# EAGLE design morseSounder (EAGLE 6.5.0)
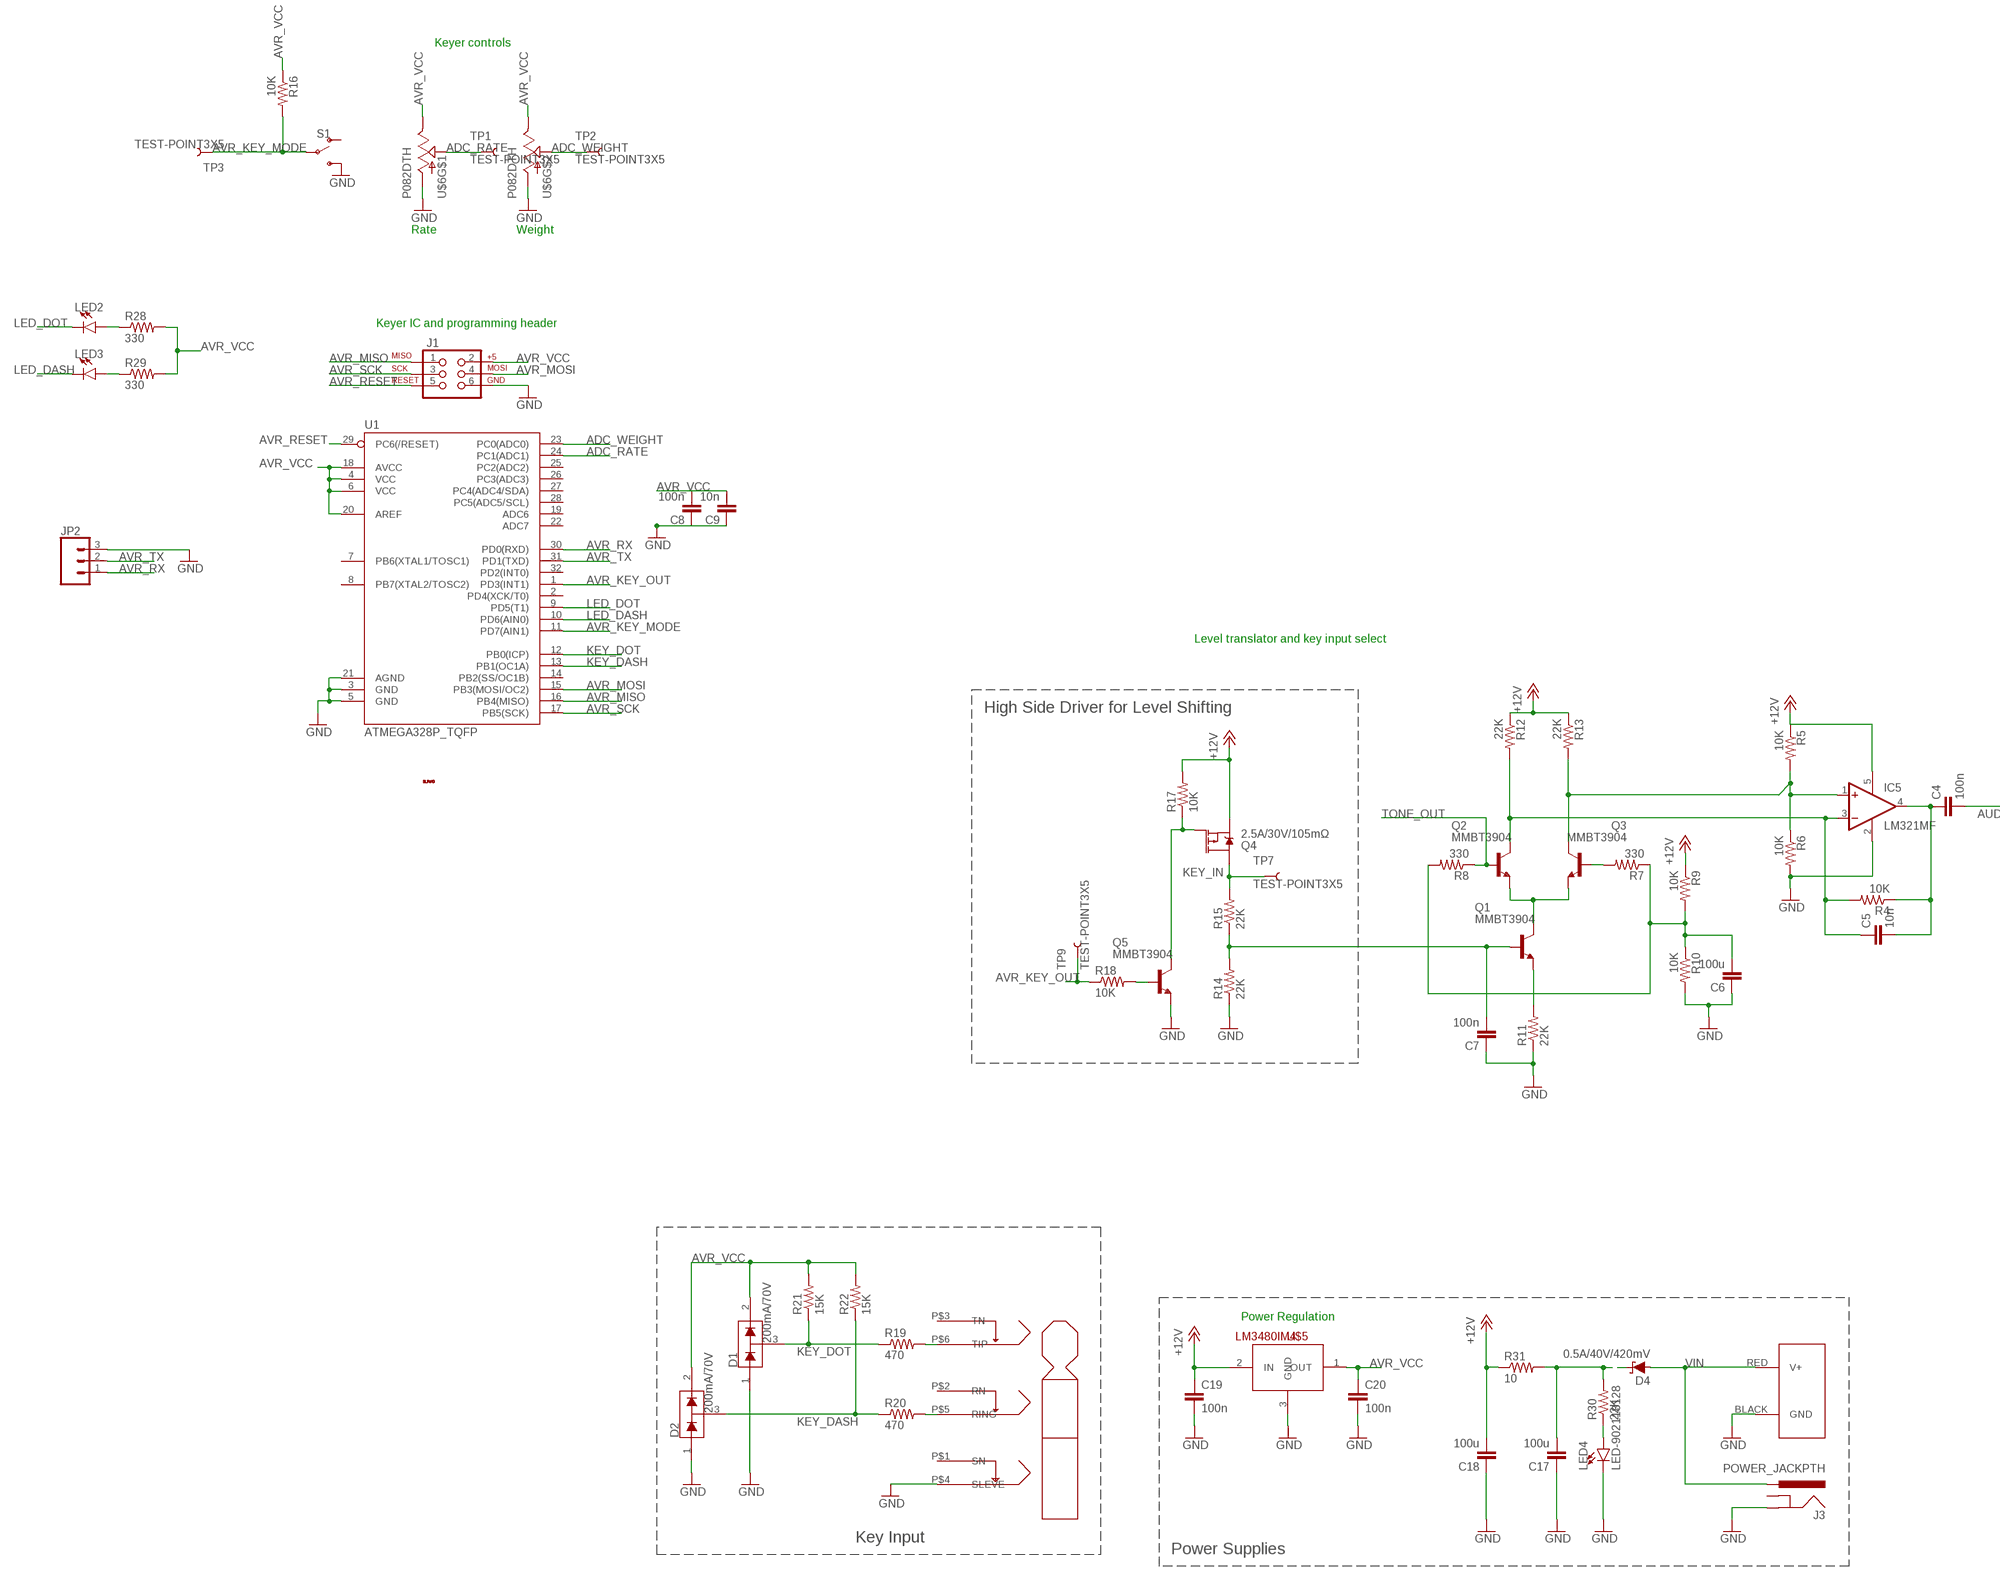
[diagram p0: schematic, sheet 1, part 1 of 2]
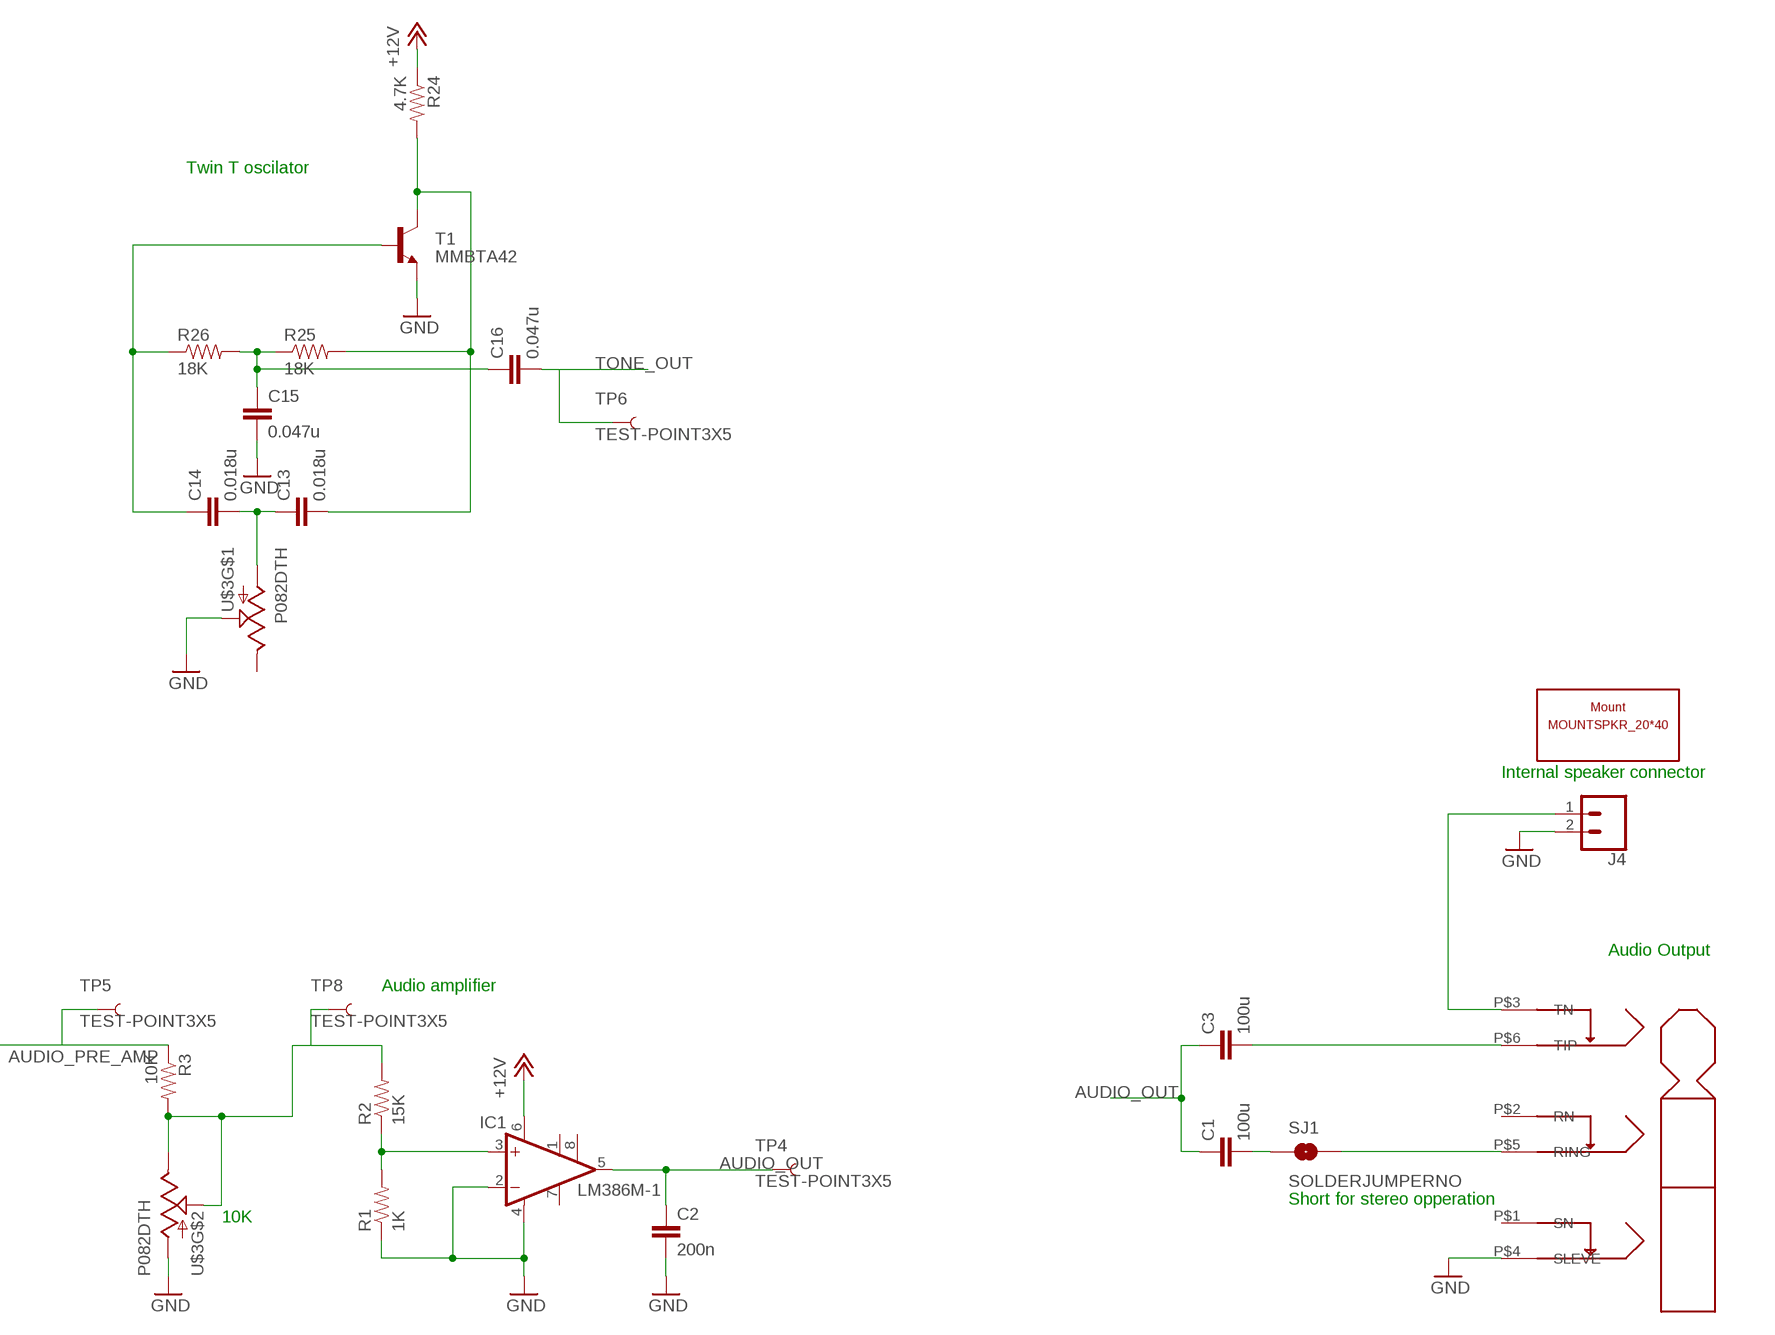
[diagram p1: schematic, sheet 1, part 2 of 2]

## Parts
C1  100u  CAP0805  [0805]
C2  200n  CAP0805  [0805]
C3  100u  CAP0805  [0805]
C4  100n  CAP0805  [0805]
C5  10n  CAP0805  [0805]
C6  100u  CAP0805  [0805]
C7  100n  CAP0805  [0805]
C8  100n  CAP0805  [0805]
C9  10n  CAP0805  [0805]
C13  0.018u  CAP0805  [0805]
C14  0.018u  CAP0805  [0805]
C15  0.047u  CAP0805  [0805]
C16  0.047u  CAP0805  [0805]
C17  100u  CAP0805  [0805]
C18  100u  CAP0805  [0805]
C19  100n  CAP0805  [0805]
C20  100n  CAP0805  [0805]
D1  200mA/70V  BAV99  [SOT23-3]
D2  200mA/70V  BAV99  [SOT23-3]
D4  0.5A/40V/420mV  DIODE-SCHOTTKY-PMEG4005EJ  [SOD-323]
IC1  LM386M-1  [SO08]
IC5  LM321MF  [SOT23-5]
J1  AVR_SPI_PRG_6PTH  [2X3]
J2  POWERPOLE_POWER25A_HORIZONTAL_G2  [POWERPOLE_PAIR_25A_HORIZ_G2]
J3  POWER_JACKPTH  [POWER_JACK_PTH]
J4  CONN_02  [1X02]
JP2  CONN_03  [1X03]
LED2  LED-RED1206  [LED-1206]
LED3  LED-RED1206  [LED-1206]
LED4  LED-902118128  [MULTICOMP-2118128]
Q1  MMBT3904  MMBT3904LT1-NPN-SOT23-BEC  [SOT23-BEC]
Q2  MMBT3904  MMBT3904LT1-NPN-SOT23-BEC  [SOT23-BEC]
Q3  MMBT3904  MMBT3904LT1-NPN-SOT23-BEC  [SOT23-BEC]
Q4  2.5A/30V/105mΩ  MOSFET_PCH-DMG2307L  [SOT23-3]
Q5  MMBT3904  MMBT3904LT1-NPN-SOT23-BEC  [SOT23-BEC]
R1  1K  RESISTOR0805-RES  [0805]
R2  15K  RESISTOR0805-RES  [0805]
R3  10K  RESISTOR0805-RES  [0805]
R4  10K  RESISTOR0805-RES  [0805]
R5  10K  RESISTOR0805-RES  [0805]
R6  10K  RESISTOR0805-RES  [0805]
R7  330  RESISTOR0805-RES  [0805]
R8  330  RESISTOR0805-RES  [0805]
R9  10K  RESISTOR0805-RES  [0805]
R10  10K  RESISTOR0805-RES  [0805]
R11  22K  RESISTOR0805-RES  [0805]
R12  22K  RESISTOR0805-RES  [0805]
R13  22K  RESISTOR0805-RES  [0805]
R14  22K  RESISTOR0805-RES  [0805]
R15  22K  RESISTOR0805-RES  [0805]
R16  10K  RESISTOR0805-RES  [0805]
R17  10K  RESISTOR0805-RES  [0805]
R18  10K  RESISTOR0805-RES  [0805]
R19  470  RESISTOR0805-RES  [0805]
R20  470  RESISTOR0805-RES  [0805]
R21  15K  RESISTOR0805-RES  [0805]
R22  15K  RESISTOR0805-RES  [0805]
R24  4.7K  RESISTOR0805-RES  [0805]
R25  18K  RESISTOR0805-RES  [0805]
R26  18K  RESISTOR0805-RES  [0805]
R28  330  RESISTOR0805-RES  [0805]
R29  330  RESISTOR0805-RES  [0805]
R30  22K  RESISTOR0805-RES  [0805]
R31  10  RESISTOR0805-RES  [0805]
S1  SWITCH-SPDTTE-1825232-1  [TE-1825232-1]
SJ1  SOLDERJUMPERNO  [SJ_2S-NO]
T1  MMBTA42  TRANSISTOR_NPNSOT23  [SOT23]
TP1  TEST-POINT3X5  [PAD.03X.05]
TP2  TEST-POINT3X5  [PAD.03X.05]
TP3  TEST-POINT3X5  [PAD.03X.05]
TP4  TEST-POINT3X5  [PAD.03X.05]
TP5  TEST-POINT3X5  [PAD.03X.05]
TP6  TEST-POINT3X5  [PAD.03X.05]
TP7  TEST-POINT3X5  [PAD.03X.05]
TP8  TEST-POINT3X5  [PAD.03X.05]
TP9  TEST-POINT3X5  [PAD.03X.05]
U1  ATMEGA328P_TQFP  [TQFP32-08]
U$1  NRJ6HH  [NRJ6HH]
U$2  NRJ6HH  [NRJ6HH]
U$3  P082DTH  [P082D]
U$4  MOUNTSPKR_20*40  [SKR_MNT]
U$5  LM3480IM4  [SOT23-3]
U$6  P082DTH  [P082D]
U$7  LOGO_SUWSLOGO_LARGE  [LOGO_SUWS]

## Nets
+12V: C18.2 C19.1 IC1.6(VS) IC5.5(V+) Q4.2(S) R5.1 R9.1 R12.1 R13.1 R17.2 R24.1 R31.1 U$5.2(IN)
ADC_RATE: TP1.P$1 U1.24(PC1(ADC1)) U$6.F2(S)
ADC_WEIGHT: TP2.P$1 U1.23(PC0(ADC0)) U$6.R2(S)
AUDIO_OUT: C1.1 C2.1 C3.1 IC1.5(OUT) TP4.P$1
AUDIO_PRE_AMP: C4.2 R3.1 TP5.P$1
AVR_KEY_MODE: R16.2 S1.2(P) TP3.P$1 U1.11(PD7(AIN1))
AVR_KEY_OUT: R18.1 TP9.P$1 U1.1(PD3(INT1))
AVR_MISO: J1.1 U1.16(PB4(MISO))
AVR_MOSI: J1.4 U1.15(PB3(MOSI/OC2))
AVR_RESET: J1.5 U1.29(PC6(/RESET))
AVR_RX: JP2.1 U1.30(PD0(RXD))
AVR_SCK: J1.3 U1.17(PB5(SCK))
AVR_TX: JP2.2 U1.31(PD1(TXD))
AVR_VCC: C8.2 C9.2 C20.1 D1.2(C2) D2.2(C2) J1.2 R16.1 R21.2 R22.2 R28.2 R29.2 U1.4(VCC) U1.6(VCC) U1.18(AVCC) U1.20(AREF) U$5.1(OUT) U$6.F3(E) U$6.R3(E)
GND: C2.2 C6.1 C7.1 C8.1 C9.1 C15.2 C17.1 C18.1 C19.2 C20.2 D1.1(A1) D2.1(A1) IC1.2(-IN) IC1.4(GND) IC5.2(V-) J1.6 J2.BLACK(GND) J3.GND J4.2 JP2.3 LED4.P$2(C) Q5.E R1.1 R6.2 R10.2 R11.1 R14.1 S1.3(S) T1.2(E) U1.3(GND) U1.5(GND) U1.21(AGND) U$1.P$4(SLEVE) U$2.P$4(SLEVE) U$3.F2(S) U$3.R1(A) U$5.3(GND) U$6.F1(A) U$6.R1(A)
KEY_DASH: D2.3(COM) R20.1 R22.1 U1.13(PB1(OC1A))
KEY_DOT: D1.3(COM) R19.1 R21.1 U1.12(PB0(ICP))
KEY_IN: Q4.3(D) R15.2 TP7.P$1
LED_DASH: LED3.C U1.10(PD6(AIN0))
LED_DOT: LED2.C U1.9(PD5(T1))
N$1: C3.2 U$2.P$6(TIP)
N$2: C1.2 SJ1.1
N$3: IC1.3(+IN) R1.2 R2.1
N$4: C17.2 D4.C R30.2 R31.2
N$5: C4.1 C5.2 IC5.4(OUT) R4.1
N$6: C5.1 IC5.3(-IN) Q2.C R4.2 R12.2
N$7: IC5.1(+IN) Q3.C R5.2 R6.1 R13.2
N$8: Q1.C Q2.E Q3.E
N$9: C7.2 Q1.B R14.2 R15.1
N$10: R20.2 U$1.P$5(RING)
N$11: Q3.B R7.2
N$12: C6.2 R7.1 R8.2 R9.2 R10.1
N$13: Q1.E R11.2
N$14: SJ1.2 U$2.P$5(RING)
N$15: R2.2 R3.2 TP8.P$1 U$3.R2(S) U$3.R3(E)
N$16: Q5.B R18.2
N$17: Q4.1(G) Q5.C R17.1
N$18: R19.2 U$1.P$6(TIP)
N$23: C13.2 R24.2 R25.2 T1.3(C)
N$24: C14.1 R26.1 T1.1(B)
N$25: C15.1 C16.1 R25.1 R26.2
N$26: C13.1 C14.2 U$3.F1(A)
N$28: J4.1 U$2.P$3(TN)
N$29: LED3.A R29.1
N$33: LED2.A R28.1
N$36: LED4.P$1(A) R30.1
TONE_OUT: C16.2 Q2.B R8.1 TP6.P$1
VIN: D4.A J2.RED(V+) J3.PWR
Unconnected: IC1.1(GAIN) IC1.7(BYPASS) IC1.8(GAIN) J3.GNDBREAK S1.1(O) U1.2(PD4(XCK/T0)) U1.7(PB6(XTAL1/TOSC1)) U1.8(PB7(XTAL2/TOSC2)) U1.14(PB2(SS/OC1B)) U1.19(ADC6) U1.22(ADC7) U1.25(PC2(ADC2)) U1.26(PC3(ADC3)) U1.27(PC4(ADC4/SDA)) U1.28(PC5(ADC5/SCL)) U1.32(PD2(INT0)) U$1.P$1(SN) U$1.P$2(RN) U$1.P$3(TN) U$2.P$1(SN) U$2.P$2(RN) U$3.F3(E)

## Notes on the sheet
- Keyer controls
- Rate | Weight | Twin T oscilator
- Keyer IC and programming header
- Internal speaker connector
- Level translator and key input select
- High Side Driver for Level Shifting
- Audio Output
- Audio amplifier
- Short for stereo opperation
- 10K
- Power Regulation
- Key Input
- Power Supplies

## Library data of the parts
C1-C9 C13-C20 = SparkFun:CAP: Capacitor Standard 0603 ceramic capacitor, and 0.1" leaded capacitor.
D1 D2 = SparkFun-DiscreteSemi:BAV99: Series-pair diode array Two small signal silicon diodes connected anode to cathode. Connections to all three nodes available. Link to datasheet <https://www.fairchildsemi.com/datasheets/BA/BAV99.pdf> SparkFun Products: SparkFun AutoDriver <https://www.sparkfun.com/products/13752>; PROD_ID: DIO-10647
D4 = SparkFun-DiscreteSemi:DIODE-SCHOTTKY: Schottky diode A Schottky diode is a semiconductor diode which has a low forward voltage drop and a very fast switching action.; PROD_ID: DIO-10955
IC1 = linear:LM386?-*: Low Voltage Audio Power Amplifier Source: http://cache.national.com/ds/LM/LM386.pdf
IC5 = linear:LM321?*: Low Power Single Op Amp Source: http://cache.national.com/ds/LM/LM321.pdf
J1 = SparkFun:AVR_SPI_PRG_6: AVR ISP 6 Pin This is the reduced ISP connector for AVR programming. Common on Arduino. This footprint will take up less PCB space and can be used with a 10-pin to 6-pin adapter such as SKU: BOB-08508
J2 = powerpoles:POWERPOLE_POWER: Anderson Powerpole Power Connector using ameteur radio standard layout
J3 = SparkFun:POWER_JACK: Power Jack This is the standard 5.5mm barrel jack for power. The PTH is the most common, proven, reliable, footprint. All others are experimental. The Slot footprint only works if the mill layer is transmitted to the PCB fab house so be warned. Spark Fun Electronics SKU : PRT-00119. Mating wall wart : TOL-00298 (and others)
J4 = SparkFun-Connectors:CONN_02: Multi connection point. Often used as Generic Header-pin footprint for 0.1 inch spaced/style header connections On any of the 0.1 inch spaced packages, you can populate with these: Break Away Headers - Straight <https://www.sparkfun.com/products/116> (PRT-00116) Break Away Male Headers - Right Angle <https://www.sparkfun.com/products/553> (PRT-00553) Female Headers <https://www.sparkfun.com/products/115> (PRT-00115) Break Away Headers - Machine Pin <https://www.sparkfun.com/products/117> (PRT-00117) Break Away Female Headers - Swiss Machine Pin <https://www.sparkfun.com/products/743> (PRT-00743) For SCREWTERMINALS and SPRING TERMINALS visit here: Screw Terimnals on SparkFun.com <https://www.sparkfun.com/search/results?term=Screw+Terminals> (5mm/3.5mm/2.54mm spacing) This device is also useful as a general connection point to wire up your design to another part of your project. Our various solder wires solder well into these plated through hole pads. Hook-Up Wire - Assortment (Stranded, 22 AWG) <https://www.sparkfun.com/products/11375> (PRT-11375) Hook-Up Wire - Assortment (Solid Core, 22 AWG) <https://www.sparkfun.com/products/11367> (PRT-11367) View the entire wire category on our website here <https://www.sparkfun.com/categories/141> Special notes: Molex polarized connector foot print use with: PRT-08233 with associated crimp pins and housings. 2.54_SCREWTERM for use with PRT-10571. 3.5mm Screw Terminal footprints for PRT-08084 5mm Screw Terminal footprints for use with PRT-08432
JP2 = SparkFun-Connectors:CONN_03: Multi connection point. Often used as Generic Header-pin footprint for 0.1 inch spaced/style header connections On any of the 0.1 inch spaced packages, you can populate with these: Break Away Headers - Straight <https://www.sparkfun.com/products/116> (PRT-00116) Break Away Male Headers - Right Angle <https://www.sparkfun.com/products/553> (PRT-00553) Female Headers <https://www.sparkfun.com/products/115> (PRT-00115) Break Away Headers - Machine Pin <https://www.sparkfun.com/products/117> (PRT-00117) Break Away Female Headers - Swiss Machine Pin <https://www.sparkfun.com/products/743> (PRT-00743) Stackable Header - 3 Pin (Female, 0.1") <https://www.sparkfun.com/products/13875> (PRT-13875) For SCREWTERMINALS and SPRING TERMINALS visit here: Screw Terimnals on SparkFun.com <https://www.sparkfun.com/search/results?term=Screw+Terminals> (5mm/3.5mm/2.54mm spacing) This device is also useful as a general connection point to wire up your design to another part of your project. Our various solder wires solder well into these plated through hole pads. Hook-Up Wire - Assortment (Stranded, 22 AWG) <https://www.sparkfun.com/products/11375> (PRT-11375) Hook-Up Wire - Assortment (Solid Core, 22 AWG) <https://www.sparkfun.com/products/11367> (PRT-11367) View the entire wire category on our website here <https://www.sparkfun.com/categories/141> Special notes: Molex polarized connector foot print use with SKU : PRT-08232 with associated crimp pins and housings.
LED2 LED3 = SparkFun-LED:LED-RED: Red SMD LED Used in manufacturing of most products at SparkFun Packages: 0603 - SMD 0603 package [Product Link] <http://docs.avagotech.com/docs/AV02-0551EN> 0603 SMART - SMD 0603 SMART package ( more efficient and expensive)[Product Link] <http://www.osram-os.com/Graphics/XPic2/00077099_0.pdf> 1206 - SMD1206 package [Product Link] <https://www.sparkfun.com/datasheets/DevTools/LilyPad/Q150OVS4.pdff> SparkFun Products: Pro Mini 328 -5V <https://www.sparkfun.com/products/821> RedBoard <https://www.sparkfun.com/products/12757> IOIO-OTG <https://www.sparkfun.com/products/13613>; PROD_ID: DIO-09912; VALUE: RED
LED4 = morseSounder:LED-90
Q1-Q3 Q5 = transistor:*-NPN-: NPN Transistror BF959 corrected 2008.03.06
Q4 = SparkFun-DiscreteSemi:MOSFET_PCH: P-channel MOSFETs Voltage controlled devices that allow control of high current outputs. SparkFun Products: SparkFun ESP32 Thing <https://www.sparkfun.com/products/13907> SparkFun ESP8266 Thing <https://www.sparkfun.com/products/13231>; PROD_ID: TRANS-11308
R1-R22 R24-R26 R28-R31 = SparkFun:RESISTOR: Resistor Basic schematic elements and footprints for 0603, 1206, and PTH resistors.
S1 = morseSounder:SWITCH-SPDT
SJ1 = SparkFun:SOLDERJUMPER: Solder Jumper Standard SMD solder jumper. Used to automate production. Two varients : Normally Open and Normally Closed are the same, but have different paste layers. NC will have a large amount of paste and should jumper during reflow.
T1 = SparkFun:TRANSISTOR_NPN: Transistor NPN BJT configuration in SOT23 package. MMBT2222 is the common NPN we use. Double check BCE configuration again layout.
TP1-TP9 = SparkFun-Connectors:TEST-POINT: SparkFun Test Points Bare copper test points for troubleshooting or In-Circuit-Testing. These are used by our Production team for verifying production board runs using pogo-pins on test beds. SparkFun Products: SparkFun LSM9DS1 Breakout <https://www.sparkfun.com/products/13284> SparkFun PSOC <https://www.sparkfun.com/products/13714> SparkFun Load Cell Amplifier <https://www.sparkfun.com/products/13879>
U1 = SparkFun-IC-Microcontroller:ATMEGA328P_TQFP: Popular 328P in QFP Storefront component: ATmega328 - TQFP <https://www.sparkfun.com/products/13448> (COM-13448) Datasheet <http://www.sparkfun.com/datasheets/Components/SMD/ATMega328.pdf> SparkFun Products SparkFun RedBoard - Programmed with Arduino <https://www.sparkfun.com/products/12757> (DEV-12757) Arduino Pro Mini 328 - 5V/16MHz <https://www.sparkfun.com/products/11113> (DEV-11113) Arduino Pro Mini 328 - 3.3V/8MHz <https://www.sparkfun.com/products/11114> (DEV-11114) SparkFun OpenLog <https://www.sparkfun.com/products/13712> (DEV-13712) SparkFun MicroView - OLED Arduino Module <https://www.sparkfun.com/products/12923> (DEV-12923) SparkFun Digital Sandbox <https://www.sparkfun.com/products/12651> (DEV-12651) SparkFun PicoBoard <https://www.sparkfun.com/products/11888> (WIG-11888) Arduino Fio <https://www.sparkfun.com/products/10116> (DEV-10116) LilyPad Arduino 328 Main Board <https://www.sparkfun.com/products/13342> (DEV-13342) SparkFun RedStick <https://www.sparkfun.com/products/13741> (DEV-13741) LilyPad MP3 <https://www.sparkfun.com/products/11013> (DEV-11013) LilyPad Arduino SimpleSnap <https://www.sparkfun.com/products/10941> (DEV-10941) SparkFun Stepoko <https://www.sparkfun.com/products/13899> (ROB-13899) SparkFun Geiger Counter <https://www.sparkfun.com/products/11345> (SEN-11345) SparkFun EL Sequencer <https://www.sparkfun.com/products/12781> (COM-12781) Arduino Pro 328 - 5V/16MHz <https://www.sparkfun.com/products/10915> (DEV-10915) CryptoCape <https://www.sparkfun.com/products/12773> (DEV-12773) SparkFun IR Thermometer Evaluation Board - MLX90614 <https://www.sparkfun.com/products/10740> (SEN-10740) SparkFun RedBot Mainboard <https://www.sparkfun.com/products/12097> (ROB-12097) Arduino Pro 328 - 3.3V/8MHz <https://www.sparkfun.com/products/10914> (DEV-10914) SparkFun Block for Intel® Edison - Arduino <https://www.sparkfun.com/products/13036> (DEV-13036) SparkFun Simon Says - Surface Mount Soldering Kit <https://www.sparkfun.com/products/10935> (KIT-10935) SparkFun 7-Segment Serial Display - Red <https://www.sparkfun.com/products/11441> (COM-11441) SparkFun 7-Segment Serial Display - White <https://www.sparkfun.com/products/11629> (COM-11629) SparkFun 7-Segment Serial Display - Yellow <https://www.sparkfun.com/products/11443> (COM-11443) SparkFun 7-Segment Serial Display - Kelly Green <https://www.sparkfun.com/products/11440> (COM-11440) SparkFun 7-Segment Serial Display - Blue <https://www.sparkfun.com/products/11442> (COM-11442) SparkFun OpenSegment Serial Display - 20mm (Blue) <https://www.sparkfun.com/products/11647> (COM-11647) SparkFun OpenSegment Serial Display - 20mm (Green) <https://www.sparkfun.com/products/11646> (COM-11646) SparkFun OpenSegment Serial Display - 20mm (White) <https://www.sparkfun.com/products/11648> (COM-11648) SparkFun OpenSegment Serial Display - 20mm (Red) <https://www.sparkfun.com/products/11644> (COM-11644) SparkFun OpenSegment Serial Display - 20mm (Yellow) <https://www.sparkfun.com/products/11645> (COM-11645) SparkFun OpenSegment Shield <https://www.sparkfun.com/products/13190> (DEV-13190); PROD_ID: IC-09069
U$1 U$2 = morseSounder:NRJ6HH
U$3 U$6 = morseSounder:P082D
U$4 = morseSounder:MOUNT
U$5 = SparkFun-PowerIC:LM3480IM4: Small package linear regulator
U$7 = morseSounder:LOGO_SUWS

## Board
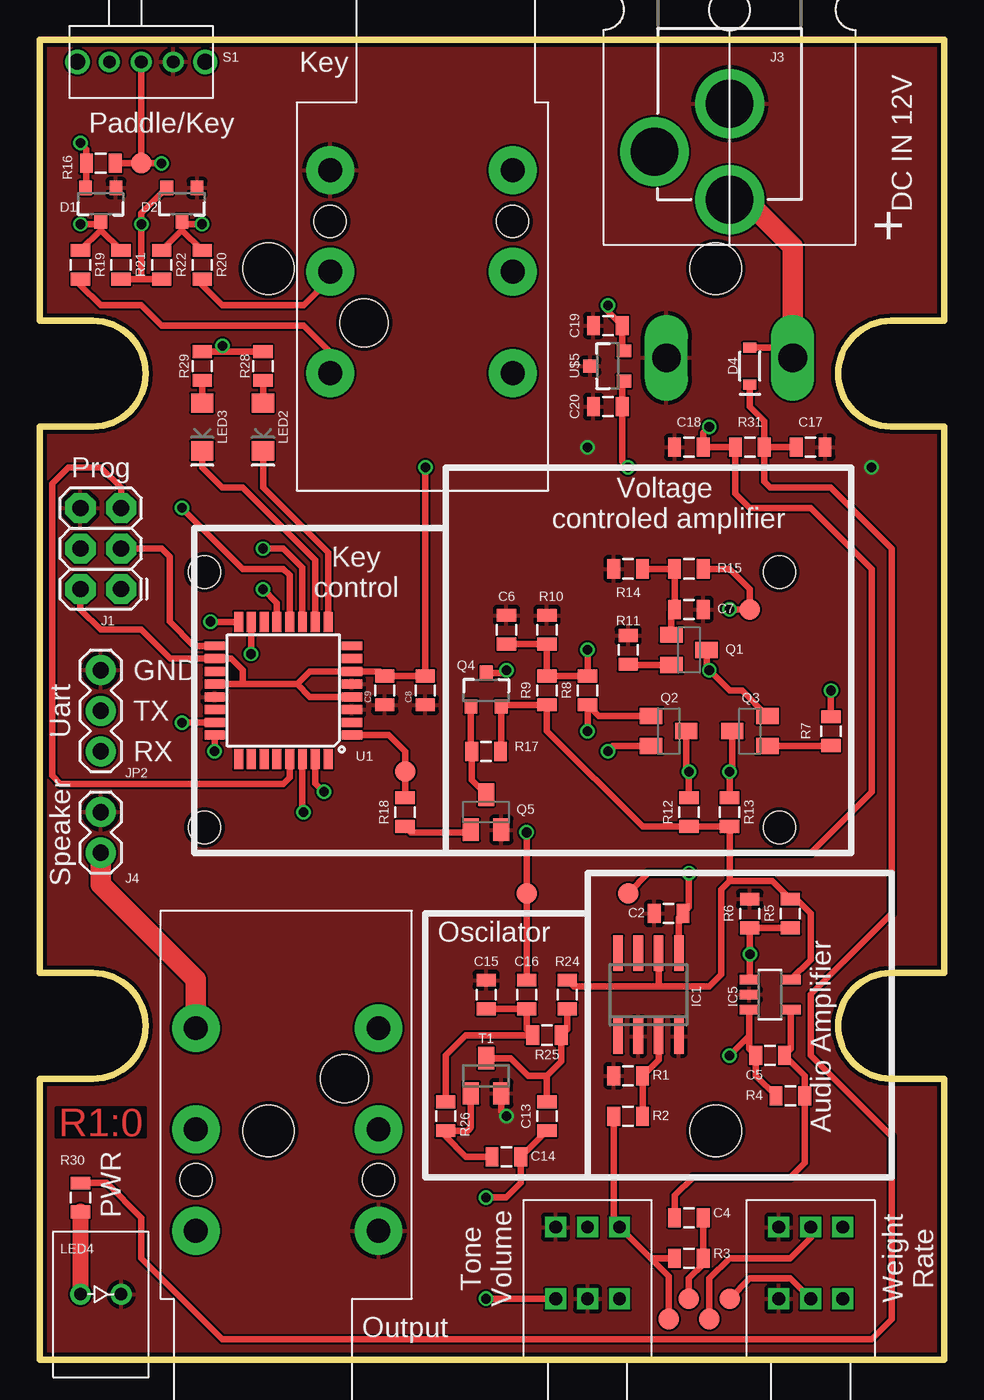
[diagram p2: board, top side]
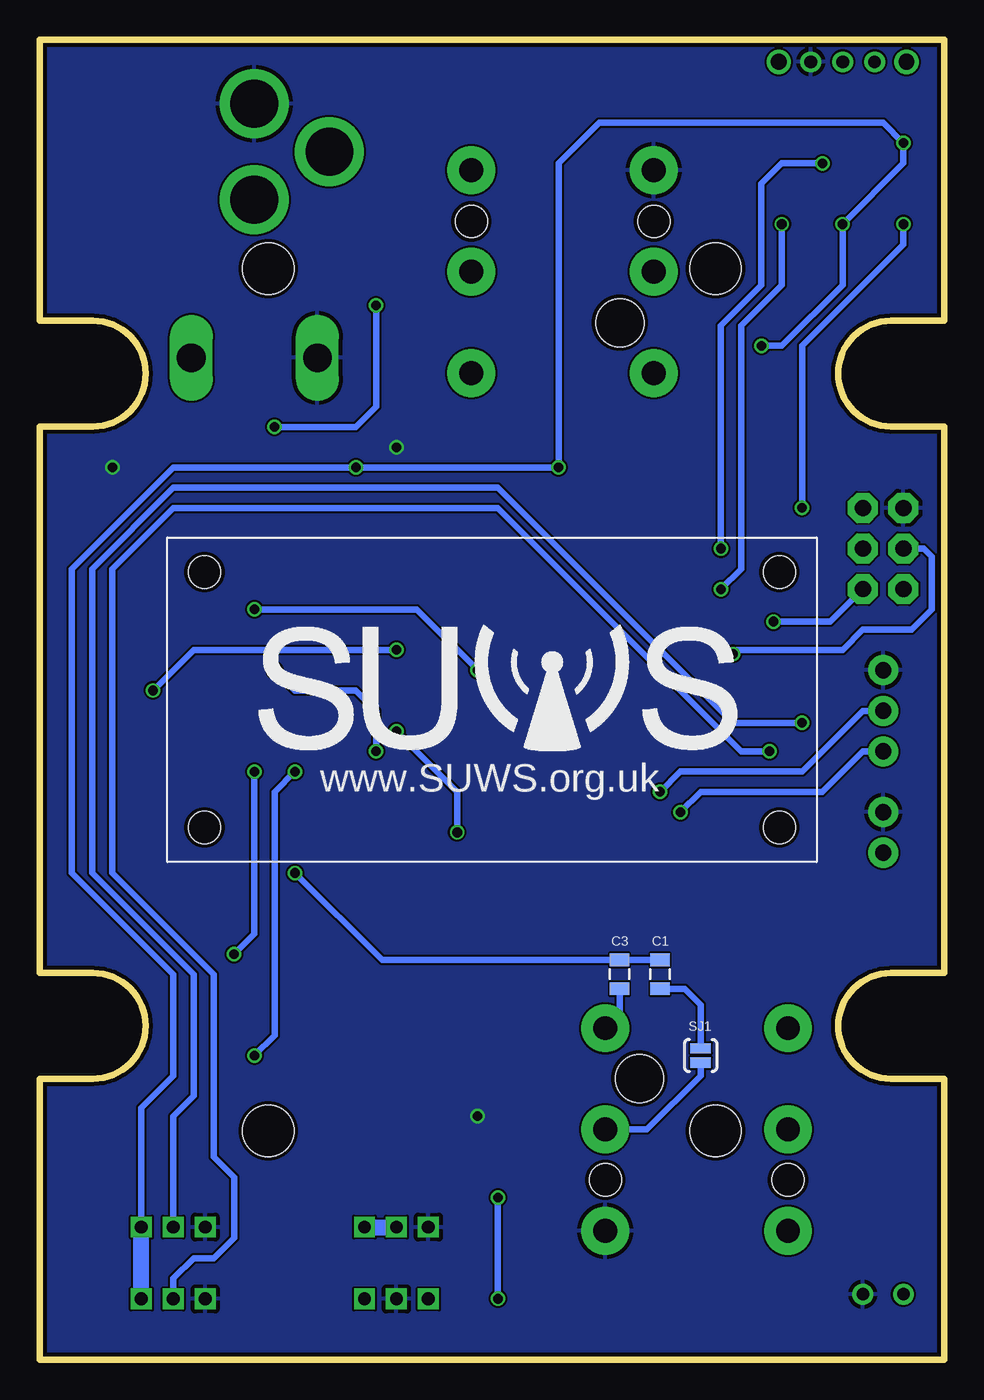
[diagram p3: board, bottom side, seen from below]

Size 56.61 x 82.66 mm. Coordinates in mm from the lower left corner, seen from the top.
Outline: 0,0 56.61,0 56.61,17.59 53.3,17.59 arc-180 53.3,24.21 56.61,24.21 56.61,58.45 53.3,58.45 arc-180 53.3,65.08 56.61,65.08 56.61,82.66 0,82.66 0,65.08 3.31,65.08 arc-180 3.31,58.45 0,58.45 0,24.21 3.31,24.21 arc-180 3.31,17.59 0,17.59 0,0
Copper layers (1*16): Top 0.035mm / dielectric 1.5mm / Bottom 0.035mm
Design rules "dirt_cheap_dirty_boards.v1": minimum track width 5mil, minimum drill 12mil, track to track 5mil, track to pad 5mil, pad to pad 5mil, via to via 5mil, smd to smd 0mil, copper to edge 10mil, drill to drill 10mil, minimum pad ring 10mil, minimum via ring 6mil, stop-mask expansion 2mil, vias tented up to drill 25mil, thermal gap 10mil
Holes 3.2 mm at 14.31,14.33 42.31,14.33 42.31,68.33 14.31,68.33

### Footprints (pad centres in the part's own frame; a part is rotated, then mirrored left to right if it is on the bottom)
0805 = smd 0.8 x 1.2: 1 -0.9,0; 2 0.9,0
SOT23-3 = smd 0.8 x 0.9: 1 -0.95,-1; 2 0.95,-1; 3 0,1.1
SOD-323 = smd 0.63 x 0.83: A 1.15,0; C -1.15,0
SO08 = smd 0.6 x 2.2: 1 -1.905,-2.6; 2 -0.635,-2.6; 3 0.635,-2.6; 4 1.905,-2.6; 5 1.905,2.6; 6 0.635,2.6; 7 -0.635,2.6; 8 -1.905,2.6
SOT23-5 = smd 0.6 x 1.2: 1 -0.95,-1.306; 2 0,-1.306; 3 0.95,-1.306; 4 0.95,1.306; 5 -0.95,1.306
2X3 = drill 1.016 pad 1.88 octagon: 1 0,0; 2 0,2.54; 3 2.54,0; 4 2.54,2.54; 5 5.08,0; 6 5.08,2.54
POWERPOLE_PAIR_25A_HORIZ_G2 = drill 1.8 long: BLACK -3.95,-7.1; RED 3.95,-7.1
POWER_JACK_PTH = drill 2.997 pad 4.318: GND 0,7.7; GNDBREAK 4.7,10.7; PWR 0,13.7
1X02 = drill 1.016 pad 1.88: 1 0,0; 2 2.54,0
1X03 = drill 1.016 pad 1.88: 1 0,0; 2 2.54,0; 3 5.08,0
LED-1206 = smd 1.2 x 1.4: A -1.5,0; C 1.5,0
MULTICOMP-2118128 = drill 0.8: P$1 -1.27,0; P$2 1.27,0
SOT23-BEC = smd 1 x 1.4: B -0.95,-1.1; C 0,1.1; E 0.95,-1.1
TE-1825232-1 = drill 0.8: 1 -2,0; 2 0,0; 3 2,0 | drill 1: M1 -4,0; M2 4,0
SJ_2S-NO = smd 0.635 x 1.27: 1 -0.45,0; 2 0.45,0
SOT23 = smd 1 x 1.4: 1 -0.95,-1.1; 2 0.95,-1.1; 3 0,1.1
PAD.03X.05 = smd 1.27 x 1.27: P$1 0,0
TQFP32-08 = smd 1.27 x 0.559: 1 -4.293,2.8; 2 -4.293,2; 3 -4.293,1.2; 4 -4.293,0.4; 5 -4.293,-0.4; 6 -4.293,-1.2; 7 -4.293,-2; 8 -4.293,-2.8; 17 4.293,-2.8; 18 4.293,-2; 19 4.293,-1.2; 20 4.293,-0.4; 21 4.293,0.4; 22 4.293,1.2; 23 4.293,2; 24 4.293,2.8 | smd 0.559 x 1.27: 9 -2.8,-4.293; 10 -2,-4.293; 11 -1.2,-4.293; 12 -0.4,-4.293; 13 0.4,-4.293; 14 1.2,-4.293; 15 2,-4.293; 16 2.8,-4.293; 25 2.8,4.293; 26 2,4.293; 27 1.2,4.293; 28 0.4,4.293; 29 -0.4,4.293; 30 -1.2,4.293; 31 -2,4.293; 32 -2.8,4.293
NRJ6HH = drill 1.5 pad 3: P$1 4.25,4.2; P$2 10.6,4.2; P$3 16.95,4.2; P$4 4.25,-7.23; P$5 10.6,-7.23; P$6 16.95,-7.23 | hole 2: 7.45,4.2; 7.45,-7.23 | hole 3: 13.8,-5.1
P082D = drill 0.8 square: F1 -2,3.8; F2 0,3.8; F3 2,3.8; R1 -2,8.3; R2 0,8.3; R3 2,8.3
SKR_MNT = hole 2: -8,18; -8,-18; 8,-18; 8,18

### Placement (x,y rotation side)
C1  17.78,24.13 270 bottom
C2  39.37,27.94 180 top
C3  20.32,24.13 270 bottom
C4  40.64,8.89 0 top
C5  45.72,19.05 0 top
C6  29.21,45.72 270 top
C7  40.64,46.99 180 top
C8  24.13,41.91 90 top
C9  21.59,41.91 90 top
C13  31.75,15.24 90 top
C14  29.21,12.7 0 top
C15  27.94,22.86 90 top
C16  30.48,22.86 90 top
C17  48.26,57.15 180 top
C18  40.64,57.15 0 top
C19  35.56,64.77 180 top
C20  35.56,59.69 180 top
D1  3.81,72.39 180 top
D2  8.89,72.39 180 top
D4  44.45,62.23 90 top
IC1  38.1,22.86 0 top
IC5  45.72,22.86 270 top
J1  5.08,48.26 90 top
J2  43.18,69.85 0 top
J3  43.18,86.36 180 top
J4  3.81,31.75 90 top
JP2  3.81,38.1 90 top
LED2  13.97,58.42 270 top
LED3  10.16,58.42 270 top
LED4  3.81,4.1 0 top
Q1  40.64,44.45 270 top
Q2  39.37,39.37 270 top
Q3  44.45,39.37 90 top
Q4  27.94,41.91 0 top
Q5  27.94,34.29 0 top
R1  36.83,17.78 0 top
R2  36.83,15.24 180 top
R3  40.64,6.35 180 top
R4  46.99,16.51 180 top
R5  46.99,27.94 270 top
R6  44.45,27.94 90 top
R7  49.53,39.37 270 top
R8  34.29,41.91 90 top
R9  31.75,41.91 90 top
R10  31.75,45.72 90 top
R11  36.83,44.45 270 top
R12  40.64,34.29 90 top
R13  43.18,34.29 90 top
R14  36.83,49.53 0 top
R15  40.64,49.53 0 top
R16  3.81,74.93 0 top
R17  27.94,38.1 0 top
R18  22.86,34.29 270 top
R19  2.54,68.58 270 top
R20  10.16,68.58 270 top
R21  5.08,68.58 270 top
R22  7.62,68.58 270 top
R24  33.02,22.86 270 top
R25  31.75,20.32 0 top
R26  25.4,15.24 90 top
R28  13.97,62.23 90 top
R29  10.16,62.23 90 top
R30  2.54,10.16 90 top
R31  44.45,57.15 0 top
S1  6.35,81.28 0 top
SJ1  15.24,19.05 270 bottom
T1  27.94,17.78 0 top
TP1  43.18,3.81 0 top
TP2  41.91,2.54 0 top
TP3  6.35,74.93 90 top
TP4  36.83,29.21 0 top
TP5  40.64,3.81 0 top
TP6  30.48,29.21 0 top
TP7  44.45,46.99 0 top
TP8  39.37,2.54 0 top
TP9  22.86,36.83 0 top
U1  15.24,41.91 180 top
U$1  25.4,78.74 270 top
U$2  13.97,3.81 90 top
U$3  34.29,0 0 top
U$4  28.3,41.33 90 bottom
U$5  35.56,62.23 90 top
U$6  48.26,0 0 top
U$7  42.93,38.1 0 bottom

### Tracks (layer width: path | path; a pad name or v marks a point on that pad's centre or on a via)
+12V  (via drill 0.6)
  Top 0.406: IC1.6 38.73,23.5 38.86,23.37 | 38.86,23.37 33.41,23.37 R24.1 | IC5.5 48.26,25.04 48.26,27.94 47.36,28.84 R5.1 45.86,29.97 43.18,29.97 | 43.18,29.97 42.67,29.46 42.67,24.13 41.91,23.37 38.86,23.37 | 43.18,29.97 43.18,31.75 | 43.18,31.75 R13.1 R12.1 37.73,33.39 31.75,39.37 R9.1 28.99,41.01 Q4.2 28.89,38.15 R17.2 | 43.18,31.75 48.26,31.75 52.07,35.56 52.07,49.53 48.26,53.34 44.45,53.34 43.55,54.24 R31.1 C18.2 41.54,58.05 v41.91,58.42 | U$5.2 36.46,63.28 C19.1 35.56,65.67 v35.56,66.04
  Bottom 0.406: v41.91,58.42 36.83,58.42 35.56,59.69 v35.56,66.04
ADC_RATE  (via drill 0.6)
  Top 0.406: U$6.F2 46.99,5.08 44.45,5.08 TP1.P$1 | v10.92,38.1 10.95,38.12 U1.24
  Bottom 0.406: U$6.F2 48.26,5.08 46.99,6.35 45.72,6.35 44.45,7.62 44.45,11.43 45.72,12.7 45.72,24.13 52.07,30.48 52.07,49.53 48.26,53.34 27.94,53.34 12.7,38.1 v10.92,38.1
ADC_WEIGHT  (via drill 0.6)
  Top 0.406: U$6.R2 48.26,7.62 46.99,6.35 43.18,6.35 41.91,5.08 TP2.P$1 | v8.89,39.88 8.92,39.91 U1.23
  Bottom 0.406: U$6.R2 48.26,15.24 46.99,16.51 46.99,24.13 53.34,30.48 53.34,49.53 48.26,54.61 27.94,54.61 13.21,39.88 v8.89,39.88
AUDIO_OUT  (via drill 0.6)
  Top 0.406: IC1.5 40.01,27.68 C2.1 40.64,28.31 v40.64,30.48 38.1,30.48 TP4.P$1
  Bottom 0.406: C1.1 C3.1 35.19,25.03 v40.64,30.48
AUDIO_PRE_AMP
  Top 0.406: C4.2 R3.1 41.54,5.98 40.64,5.08 TP5.P$1
AVR_KEY_MODE  (via drill 0.6)
  Top 0.406: S1.2 TP3.P$1 | TP3.P$1 R16.2 | TP3.P$1 v7.62,74.93 | U1.11 16.44,49.6 15.24,50.8 v13.97,50.8
  Bottom 0.406: v7.62,74.93 10.16,74.93 11.43,73.66 11.43,67.31 13.97,64.77 v13.97,50.8
AVR_KEY_OUT
  Top 0.406: R18.1 TP9.P$1 22.86,38.1 21.85,39.11 U1.1
AVR_MISO  (via drill 0.6)
  Top 0.406: U1.16 10.69,46.2 v10.67,46.23
  Bottom 0.406: v10.67,46.23 7.11,46.23 J1.1
AVR_MOSI  (via drill 0.6)
  Top 0.406: U1.15 13.24,44.16 v13.21,44.2
  Bottom 0.406: v13.21,44.2 12.95,44.45 6.35,44.45 5.08,45.72 2.03,45.72 0.76,46.99 0.76,50.29 1.27,50.8 J1.4
AVR_RESET
  Top 0.406: J1.5 5.08,54.61 3.81,55.88 1.78,55.88 0.76,54.86 0.76,36.58 1.27,36.07 15.24,36.07 15.64,36.47 U1.29
AVR_RX  (via drill 0.6)
  Top 0.406: U1.30 16.44,34.36 v16.51,34.29
  Bottom 0.406: v16.51,34.29 15.24,35.56 7.62,35.56 5.08,38.1 JP2.1
AVR_SCK
  Top 0.406: U1.17 9.65,44.71 8.13,46.23 8.13,50.29 7.62,50.8 J1.3
AVR_TX  (via drill 0.6)
  Top 0.406: U1.31 17.24,36.1 v17.78,35.56
  Bottom 0.406: v17.78,35.56 16.51,36.83 8.89,36.83 5.08,40.64 JP2.2
AVR_VCC  (via drill 0.6)
  Top 0.406: R21.2 R22.2 6.49,67.68 6.35,67.82 v6.35,71.12 6.35,71.8 D2.2 | v2.54,76.2 2.91,75.83 R16.1 2.91,73.44 D1.2 | R28.2 R29.2 11.06,63.13 v11.43,63.5 | U$5.1 36.46,61.18 C20.1 36.46,56.25 v36.83,55.88 | U1.20 12.7,42.31 | 12.7,42.31 16.11,42.31 | U1.4 16.91,41.51 16.11,42.31 | 16.11,42.31 16.91,43.11 U1.6 21.29,43.11 C9.2 C8.2 v24.13,55.88 | 12.7,42.31 12.7,43.18 11.97,43.91 U1.18 8.16,43.91 6.35,45.72 3.81,45.72 2.54,46.99 J1.2
  Bottom 0.406: U$6.R3 50.26,15.78 48.26,17.78 48.26,24.13 54.61,30.48 54.61,49.53 48.26,55.88 v36.83,55.88 v24.13,55.88 24.13,74.93 21.59,77.47 3.81,77.47 v2.54,76.2 2.54,74.93 v6.35,71.12 6.35,67.31 10.16,63.5 v11.43,63.5
  Bottom 1: U$6.F3 U$6.R3
GND  (via drill 0.6)
  Top 0.406: T1.2 28.89,15.56 v29.21,15.24
  other vias: 52.07,55.88 34.29,57.15
  pour Top: -2.54,-2.54 59.69,-2.54 59.69,85.09 -2.54,85.09
  pour Bottom: -1.27,-3.81 58.42,-3.81 58.42,83.82 -1.27,83.82
KEY_DASH  (via drill 0.6)
  Top 0.406: 8.89,70.75 R20.1 | 8.89,70.75 D2.3 9.06,71.12 v10.16,71.12 | 8.89,70.75 R22.1 | U1.13 14.84,47.39 v13.97,48.26
  Bottom 0.406: v13.97,48.26 12.7,49.53 12.7,64.77 10.16,67.31 v10.16,71.12
KEY_DOT  (via drill 0.6)
  Top 0.406: 3.81,70.75 R21.1 | 3.81,70.75 D1.3 3.64,71.12 v2.54,71.12 | 3.81,70.75 R19.1 | U1.12 15.64,49.13 15.24,49.53 12.7,49.53 v8.89,53.34
  Bottom 0.406: v8.89,53.34 8.89,63.5 2.54,69.85 v2.54,71.12
KEY_IN  (via drill 0.6)
  Top 0.406: R15.2 43.18,49.53 44.45,48.26 TP7.P$1 v43.18,46.99 | Q4.3 29.04,43.01 v29.21,43.18
  Bottom 0.406: v29.21,43.18 33.02,46.99 v43.18,46.99
LED_DASH
  Top 0.406: U1.10 17.24,50.07 12.7,54.61 11.43,54.61 10.16,55.88 LED3.C
LED_DOT
  Top 0.406: U1.9 18.04,50.54 13.97,54.61 LED2.C
N$1
  Bottom 0.406: U$2.P$6 20.32,21.64 C3.2
N$2
  Bottom 0.406: SJ1.1 15.24,22.23 16.24,23.23 C1.2
N$3
  Top 0.406: IC1.3 38.73,18.79 R1.2 R2.1
N$4
  Top 0.406: 47.13,57.38 C17.2 R31.2 | R31.2 45.35,54.98 45.72,54.61 49.53,54.61 53.34,50.8 53.34,27.94 48.26,22.86 48.26,19.05 53.34,13.97 53.34,2.54 52.07,1.27 11.43,1.27 6.35,6.35 6.35,8.89 4.18,11.06 R30.2 | R31.2 45.35,58.79 44.45,59.69 D4.C
N$5
  Top 0.406: IC5.4 47.03,19.46 C5.2 47.89,17.78 R4.1 47.89,12.33 46.99,11.43 40.89,11.43 39.74,10.28 C4.1
N$6  (via drill 0.6)
  Top 0.406: R4.2 44.82,17.78 C5.1 44.41,19.46 IC5.3 44.41,20.28 v43.18,19.05 | R12.2 v40.64,36.83 40.47,37 Q2.C
  Bottom 0.406: v43.18,19.05 41.91,20.32 41.91,35.56 v40.64,36.83
N$7  (via drill 0.6)
  Top 0.406: R5.2 R6.1 v44.45,25.4 44.45,23.85 IC5.1 | R13.2 v43.18,36.83 43.35,37 Q3.C
  Bottom 0.406: v43.18,36.83 43.18,26.67 v44.45,25.4
N$8  (via drill 0.6)
  Top 0.406: Q1.C 41.74,43.35 v41.91,43.18 43.18,41.91 43.96,41.91 Q3.E | Q2.E 35.88,38.42 v35.56,38.1
  Bottom 0.406: v35.56,38.1 35.56,40.64 36.83,41.91 40.64,41.91 v41.91,43.18
N$9
  Top 0.406: Q1.B 39.54,46.79 C7.2 R15.1 R14.2
N$10
  Top 0.406: U$1.P$5 18.17,67.7 16.51,66.04 11.43,66.04 10.16,67.31 R20.2
N$11
  Top 0.406: Q3.B 49.48,38.42 R7.2
N$12  (via drill 0.6)
  Top 0.406: C6.2 R10.1 R9.2 R8.2 v34.29,44.45 | R7.1 v49.53,41.91
  Bottom 0.406: v49.53,41.91 46.99,44.45 v34.29,44.45
N$13
  Top 0.406: Q1.E 36.88,43.5 R11.2
N$14
  Bottom 0.406: SJ1.2 15.24,17.78 18.61,14.41 U$2.P$5
N$15
  Top 0.406: R2.2 35.93,8.66 U$3.R3 38.17,6.42 38.24,6.35 | R3.2 38.24,6.35 | TP8.P$1 39.37,5.22 38.24,6.35
  Bottom 1: U$3.R3 U$3.R2
N$16
  Top 0.406: Q5.B 26.82,33.02 23.23,33.02 R18.2
N$17
  Top 0.406: Q5.C 27.04,36.29 R17.1 26.99,38.15 Q4.1
N$18
  Top 0.406: U$1.P$6 18.17,63.11 16.51,64.77 7.62,64.77 6.35,66.04 3.81,66.04 2.54,67.31 R19.2
N$23
  Top 0.406: T1.3 29.48,18.88 30.58,17.78 31.75,17.78 | R24.2 33.02,20.69 R25.2 32.65,18.68 31.75,17.78 | C13.2 31.75,17.78
N$24
  Top 0.406: T1.1 26.99,14.55 26.78,14.34 R26.1 25.4,13.97 26.67,12.7 C14.1
N$25
  Top 0.406: C15.1 C16.1 30.48,20.69 R25.1 26.67,20.32 25.4,19.05 R26.2
N$26  (via drill 0.6)
  Top 0.406: U$3.F1 v27.94,3.81 | C13.1 C14.2 30.11,11.06 29.21,10.16 v27.94,10.16
  Bottom 0.406: v27.94,3.81 v27.94,10.16
N$28
  Top 1.27: U$2.P$3 9.77,23.81 3.81,29.77 J4.1
N$29
  Top 0.406: LED3.A R29.1
N$33
  Top 0.406: LED2.A R28.1
N$36
  Top 1: R30.1 LED4.P$1
TONE_OUT  (via drill 0.6)
  Top 0.406: Q2.B 34.98,40.32 R8.1 v34.29,39.37 | C16.2 TP6.P$1 v30.48,33.02
  Bottom 0.406: v30.48,33.02 30.48,35.56 v34.29,39.37
VIN
  Top 0.406: D4.A 46.5,63.38 J2.RED
  Top 1.27: J3.PWR 44.18,72.66 47.13,69.71 J2.RED

### Text on the board
Top: R1:0
tPlace: Key | Paddle/Key | Prog | GND | Uart | TX | RX | Speaker | Output
tNames: DC IN 12V | Voltage / controled amplifier | Key / control | Oscilator | Audio Amplifier | PWR | Tone / Volume | Weight / Rate
bNames: www.SUWS.org.uk
tStop: R1:0